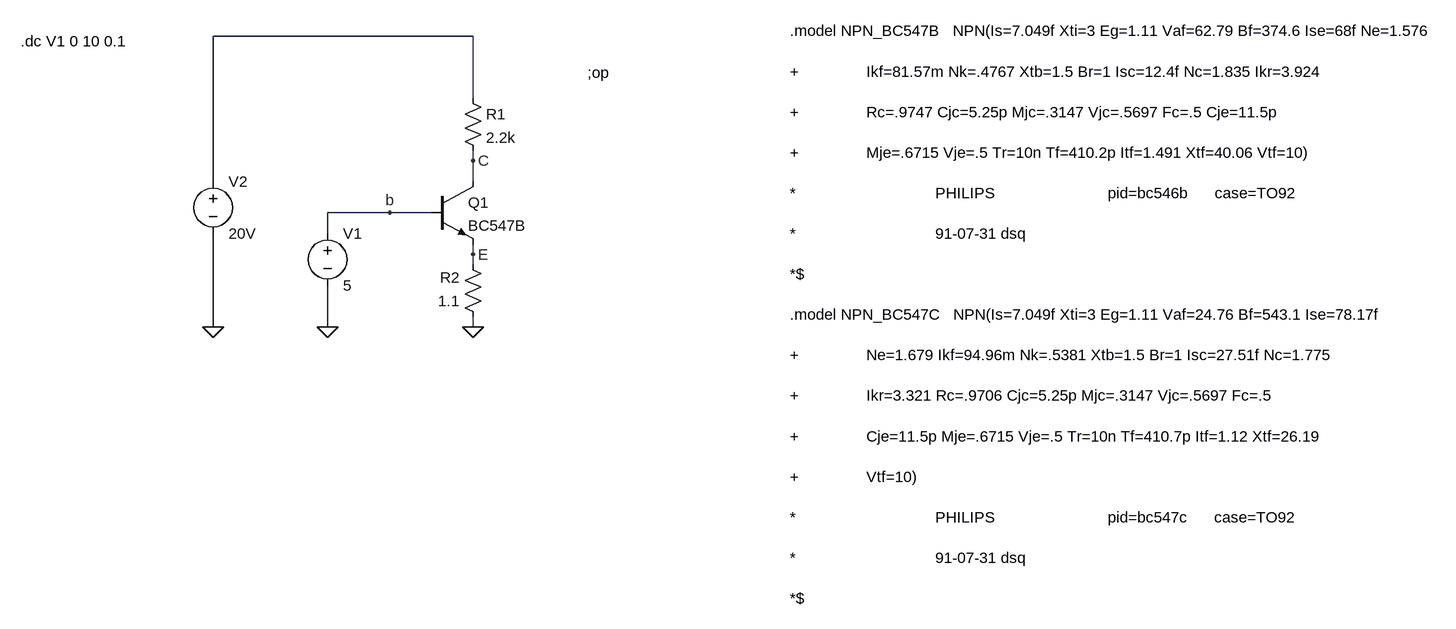
[diagram p0: schematic Draft1.asc]
Draft1.asc, the LTspice schematic file:
Version 4
SHEET 1 1800 680
WIRE 176 -112 -224 -112
WIRE 176 -16 176 -112
WIRE 176 80 176 64
WIRE -224 112 -224 -112
WIRE 176 112 176 80
WIRE 48 160 -48 160
WIRE 112 160 48 160
WIRE -48 192 -48 160
WIRE 176 224 176 208
WIRE 176 240 176 224
WIRE -224 336 -224 192
WIRE -48 336 -48 272
WIRE 176 336 176 320
FLAG 176 336 0
FLAG -224 336 0
FLAG -48 336 0
FLAG 48 160 b
FLAG 176 80 C
FLAG 176 224 E
SYMBOL npn 112 112 R0
SYMATTR InstName Q1
SYMATTR Value BC547B
SYMBOL voltage -224 96 R0
SYMATTR InstName V2
SYMATTR Value 20V
SYMBOL res 160 -32 R0
SYMATTR InstName R1
SYMATTR Value 2.2k
SYMBOL res 192 336 R180
WINDOW 0 36 76 Left 2
WINDOW 3 36 40 Left 2
SYMATTR InstName R2
SYMATTR Value 1.1
SYMBOL voltage -48 176 R0
WINDOW 123 0 0 Left 2
WINDOW 39 0 0 Left 2
SYMATTR InstName V1
SYMATTR Value 5
TEXT -520 -104 Left 2 !.dc V1 0 10 0.1
TEXT 664 -120 Left 2 !.model NPN_BC547B   NPN(Is=7.049f Xti=3 Eg=1.11 Vaf=62.79 Bf=374.6 Ise=68f Ne=1.576\n\n+               Ikf=81.57m Nk=.4767 Xtb=1.5 Br=1 Isc=12.4f Nc=1.835 Ikr=3.924\n\n+               Rc=.9747 Cjc=5.25p Mjc=.3147 Vjc=.5697 Fc=.5 Cje=11.5p\n\n+               Mje=.6715 Vje=.5 Tr=10n Tf=410.2p Itf=1.491 Xtf=40.06 Vtf=10)\n\n*                               PHILIPS                         pid=bc546b      case=TO92\n\n*                               91-07-31 dsq\n\n*$\n\n.model NPN_BC547C   NPN(Is=7.049f Xti=3 Eg=1.11 Vaf=24.76 Bf=543.1 Ise=78.17f\n\n+               Ne=1.679 Ikf=94.96m Nk=.5381 Xtb=1.5 Br=1 Isc=27.51f Nc=1.775\n\n+               Ikr=3.321 Rc=.9706 Cjc=5.25p Mjc=.3147 Vjc=.5697 Fc=.5\n\n+               Cje=11.5p Mje=.6715 Vje=.5 Tr=10n Tf=410.7p Itf=1.12 Xtf=26.19\n\n+               Vtf=10)\n\n*                               PHILIPS                         pid=bc547c      case=TO92\n\n*                               91-07-31 dsq\n\n*$
TEXT 352 -56 Left 2 !;op

The netlist it stands for:
* Draft1.asc
Q1 C b E 0 BC547B
V2 N001 0 20V
R1 N001 C 2.2k
R2 0 E 1.1
V1 b 0 5
.model NPN NPN
.model PNP PNP
.lib standard.bjt
.dc V1 0 10 0.1
.model NPN_BC547B   NPN(Is=7.049f Xti=3 Eg=1.11 Vaf=62.79 Bf=374.6 Ise=68f Ne=1.576
+               Ikf=81.57m Nk=.4767 Xtb=1.5 Br=1 Isc=12.4f Nc=1.835 Ikr=3.924
+               Rc=.9747 Cjc=5.25p Mjc=.3147 Vjc=.5697 Fc=.5 Cje=11.5p
+               Mje=.6715 Vje=.5 Tr=10n Tf=410.2p Itf=1.491 Xtf=40.06 Vtf=10)
*                               PHILIPS                         pid=bc546b      case=TO92
*                               91-07-31 dsq
*$
.model NPN_BC547C   NPN(Is=7.049f Xti=3 Eg=1.11 Vaf=24.76 Bf=543.1 Ise=78.17f
+               Ne=1.679 Ikf=94.96m Nk=.5381 Xtb=1.5 Br=1 Isc=27.51f Nc=1.775
+               Ikr=3.321 Rc=.9706 Cjc=5.25p Mjc=.3147 Vjc=.5697 Fc=.5
+               Cje=11.5p Mje=.6715 Vje=.5 Tr=10n Tf=410.7p Itf=1.12 Xtf=26.19
+               Vtf=10)
*                               PHILIPS                         pid=bc547c      case=TO92
*                               91-07-31 dsq
*$
;op
.backanno
.end